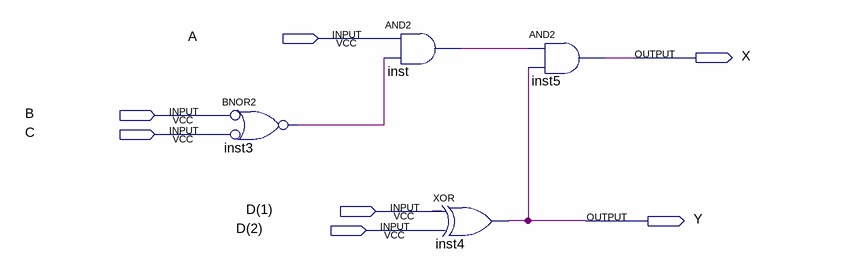
[diagram p0: schematic sheet]
// Quartus schematic Block1.bdf as structural Verilog: 4 symbols, 7 pins
module Block1 (
  input  A,
  input  B,
  input  C,
  input  \D(1) ,
  input  \D(2) ,
  output X,
  output Y
);

  wire inst3_out, inst_out;

  nor inst3 (inst3_out, ~B, ~C);  // BNOR2
  and inst (inst_out, A, inst3_out);
  xor inst4 (Y, \D(1) , \D(2) );
  and inst5 (X, inst_out, Y);
endmodule
